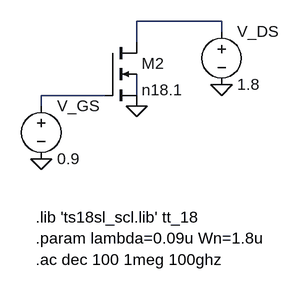
[diagram p0: schematic 3.asc]
3.asc, the LTspice schematic file:
Version 4
SHEET 1 936 680
WIRE 832 -16 704 -16
WIRE 832 0 832 -16
WIRE 704 16 704 -16
WIRE 656 96 560 96
WIRE 704 96 704 64
WIRE 560 112 560 96
FLAG 560 192 0
FLAG 704 112 0
FLAG 832 80 0
SYMBOL voltage 560 96 R0
WINDOW 123 0 0 Left 0
WINDOW 39 0 0 Left 0
SYMATTR InstName V_GS
SYMATTR Value 0.9
SYMBOL voltage 832 -16 R0
WINDOW 123 0 0 Left 0
WINDOW 39 0 0 Left 0
SYMATTR InstName V_DS
SYMATTR Value 1.8
SYMBOL nmos4 656 16 R0
SYMATTR InstName M2
SYMATTR Value n18.1
SYMATTR Value2 l={2*lambda} w={Wn} ad={5*lambda*Wn} as={5*lambda*Wn} pd={2*Wn + 10*lambda} ps={2*Wn + 10*lambda}
TEXT 552 312 Left 2 !.param lambda=0.09u Wn=1.8u
TEXT 552 280 Left 2 !.lib 'ts18sl_scl.lib' tt_18
TEXT 552 344 Left 2 !.ac dec 100 1meg 100ghz

The netlist it stands for:
* 3.asc
V_GS N002 0 0.9
V_DS N001 0 1.8
M2 N001 N002 0 N003 n18.1 l={2*lambda} w={Wn} ad={5*lambda*Wn} as={5*lambda*Wn} pd={2*Wn + 10*lambda} ps={2*Wn + 10*lambda}
.model NMOS NMOS
.model PMOS PMOS
.lib standard.mos
.param lambda=0.09u Wn=1.8u
.lib 'ts18sl_scl.lib' tt_18
.ac dec 100 1meg 100ghz
.backanno
.end